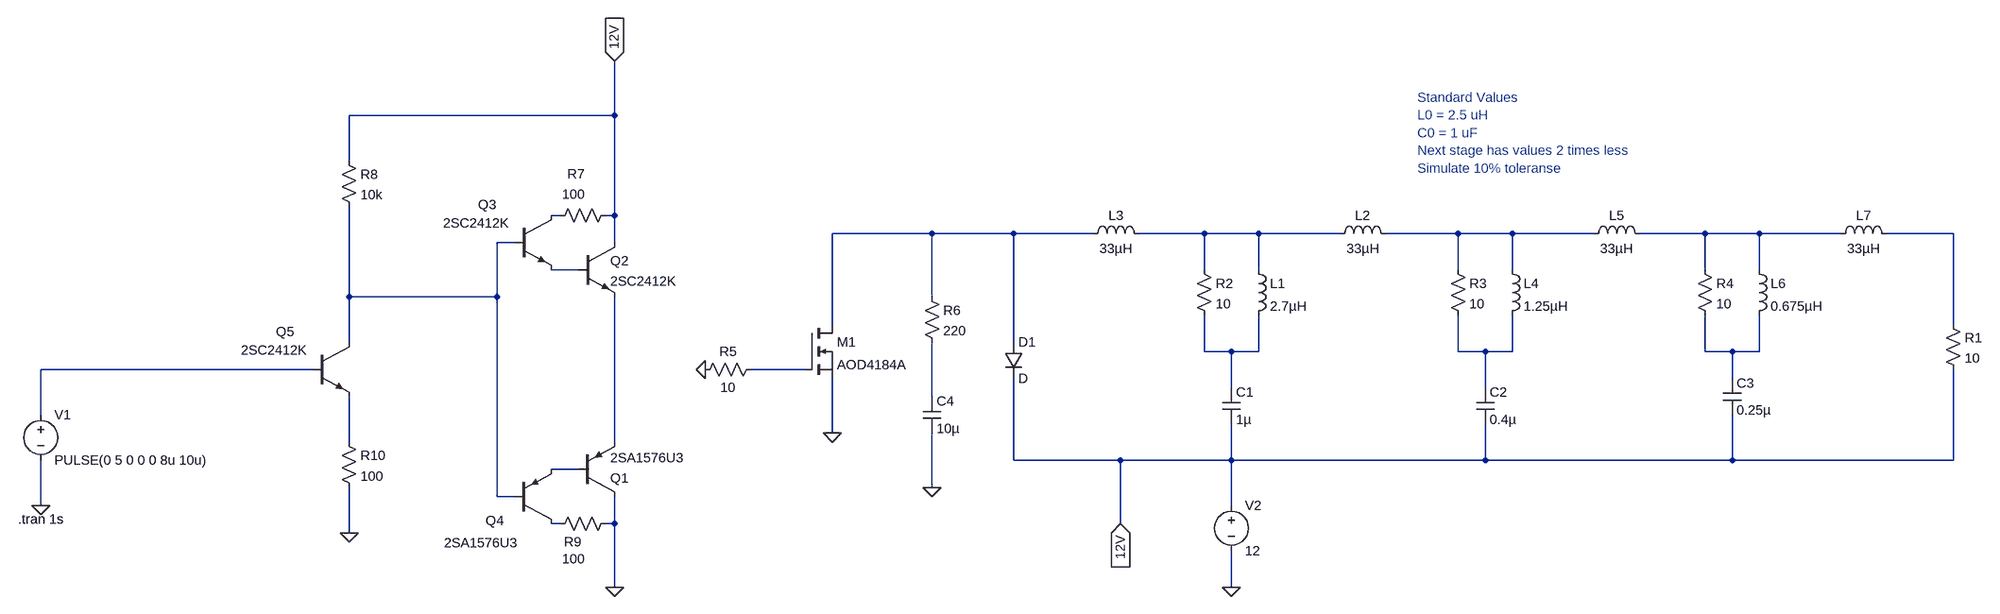
[diagram p0: schematic PWM_concept_05.asc]
PWM_concept_05.asc, the LTspice schematic file:
Version 4
SHEET 1 3368 680
WIRE -928 -176 -928 -272
WIRE -928 -176 -1520 -176
WIRE -1520 -96 -1520 -176
WIRE -1024 0 -1040 0
WIRE -928 0 -928 -176
WIRE -928 0 -944 0
WIRE -368 32 -544 32
WIRE -224 32 -368 32
WIRE -80 32 -224 32
WIRE 144 32 0 32
WIRE 240 32 144 32
WIRE 384 32 240 32
WIRE 592 32 464 32
WIRE 688 32 592 32
WIRE 832 32 688 32
WIRE 1056 32 912 32
WIRE 1152 32 1056 32
WIRE 1296 32 1152 32
WIRE 1504 32 1376 32
WIRE -1104 48 -1136 48
WIRE -928 48 -928 0
WIRE -992 96 -1040 96
WIRE 144 96 144 32
WIRE 240 96 240 32
WIRE 592 96 592 32
WIRE 688 96 688 32
WIRE 1056 96 1056 32
WIRE 1152 96 1152 32
WIRE -1520 144 -1520 -16
WIRE -1136 144 -1136 48
WIRE -1136 144 -1520 144
WIRE -368 144 -368 32
WIRE -544 192 -544 32
WIRE 1504 192 1504 32
WIRE -1520 224 -1520 144
WIRE -224 224 -224 32
WIRE 144 240 144 176
WIRE 192 240 144 240
WIRE 240 240 240 176
WIRE 240 240 192 240
WIRE 592 240 592 176
WIRE 640 240 592 240
WIRE 688 240 688 176
WIRE 688 240 640 240
WIRE 1056 240 1056 176
WIRE 1104 240 1056 240
WIRE 1152 240 1152 176
WIRE 1152 240 1104 240
WIRE -1584 272 -2064 272
WIRE -592 272 -688 272
WIRE 1104 288 1104 240
WIRE 192 304 192 240
WIRE 640 304 640 240
WIRE -368 320 -368 224
WIRE -2064 352 -2064 272
WIRE -544 384 -544 288
WIRE -1520 400 -1520 320
WIRE -928 400 -928 144
WIRE -224 432 -224 288
WIRE -32 432 -224 432
WIRE 192 432 192 368
WIRE 192 432 -32 432
WIRE 640 432 640 368
WIRE 640 432 192 432
WIRE 1104 432 1104 352
WIRE 1104 432 640 432
WIRE 1504 432 1504 272
WIRE 1504 432 1104 432
WIRE -992 448 -1040 448
WIRE -368 480 -368 384
WIRE -1136 496 -1136 144
WIRE -1104 496 -1136 496
WIRE -2064 512 -2064 432
WIRE 192 512 192 432
WIRE -1024 544 -1040 544
WIRE -928 544 -928 496
WIRE -928 544 -944 544
WIRE -32 544 -32 432
WIRE -1520 560 -1520 480
WIRE -928 656 -928 544
WIRE 192 656 192 592
FLAG -2064 512 0
FLAG -544 384 0
FLAG 192 656 0
FLAG -368 480 0
FLAG -928 656 0
FLAG -928 -272 12V
IOPIN -928 -272 In
FLAG -32 544 12V
IOPIN -32 544 In
FLAG -1520 560 0
FLAG -768 272 0
SYMBOL voltage -2064 336 R0
WINDOW 123 0 0 Left 0
WINDOW 39 0 0 Left 0
SYMATTR InstName V1
SYMATTR Value PULSE(0 5 0 0 0 8u 10u)
SYMBOL res 1488 176 R0
SYMATTR InstName R1
SYMATTR Value 10
SYMBOL cap 176 304 R0
SYMATTR InstName C1
SYMATTR Value 1µ
SYMBOL ind 224 80 R0
SYMATTR InstName L1
SYMATTR Value 2.7µH
SYMBOL ind 368 48 R270
WINDOW 0 32 56 VTop 2
WINDOW 3 5 56 VBottom 2
SYMATTR InstName L2
SYMATTR Value 33µH
SYMBOL ind -96 48 R270
WINDOW 0 32 56 VTop 2
WINDOW 3 5 56 VBottom 2
SYMATTR InstName L3
SYMATTR Value 33µH
SYMBOL cap 624 304 R0
SYMATTR InstName C2
SYMATTR Value 0.4µ
SYMBOL ind 672 80 R0
SYMATTR InstName L4
SYMATTR Value 1.25µH
SYMBOL ind 816 48 R270
WINDOW 0 32 56 VTop 2
WINDOW 3 5 56 VBottom 2
SYMATTR InstName L5
SYMATTR Value 33µH
SYMBOL cap 1088 288 R0
SYMATTR InstName C3
SYMATTR Value 0.25µ
SYMBOL ind 1136 80 R0
SYMATTR InstName L6
SYMATTR Value 0.675µH
SYMBOL ind 1280 48 R270
WINDOW 0 32 56 VTop 2
WINDOW 3 5 56 VBottom 2
SYMATTR InstName L7
SYMATTR Value 33µH
SYMBOL res 128 80 R0
SYMATTR InstName R2
SYMATTR Value 10
SYMBOL res 576 80 R0
SYMATTR InstName R3
SYMATTR Value 10
SYMBOL res 1040 80 R0
SYMATTR InstName R4
SYMATTR Value 10
SYMBOL res -672 256 R90
WINDOW 0 0 56 VBottom 2
WINDOW 3 32 56 VTop 2
SYMATTR InstName R5
SYMATTR Value 10
SYMBOL voltage 192 496 R0
WINDOW 123 0 0 Left 0
WINDOW 39 0 0 Left 0
SYMATTR InstName V2
SYMATTR Value 12
SYMBOL nmos -592 192 R0
SYMATTR InstName M1
SYMATTR Value AOD4184A
SYMBOL diode -240 224 R0
SYMATTR InstName D1
SYMBOL cap -384 320 R0
SYMATTR InstName C4
SYMATTR Value 10µ
SYMBOL res -384 128 R0
SYMATTR InstName R6
SYMATTR Value 220
SYMBOL pnp -992 496 M180
SYMATTR InstName Q1
SYMATTR Value 2SA1576U3
SYMBOL npn -992 48 R0
SYMATTR InstName Q2
SYMATTR Value 2SC2412K
SYMBOL npn -1104 0 R0
WINDOW 0 -65 -19 Left 2
WINDOW 3 -127 14 Left 2
SYMATTR InstName Q3
SYMATTR Value 2SC2412K
SYMBOL res -928 -16 R90
WINDOW 0 -41 68 VBottom 2
WINDOW 3 -37 72 VTop 2
SYMATTR InstName R7
SYMATTR Value 100
SYMBOL res -1536 -112 R0
SYMATTR InstName R8
SYMATTR Value 10k
SYMBOL pnp -1104 544 M180
WINDOW 0 -52 5 Left 2
WINDOW 3 -125 -34 Left 2
SYMATTR InstName Q4
SYMATTR Value 2SA1576U3
SYMBOL res -928 528 R90
WINDOW 0 64 74 VBottom 2
WINDOW 3 63 72 VTop 2
SYMATTR InstName R9
SYMATTR Value 100
SYMBOL npn -1584 224 R0
WINDOW 0 -65 -19 Left 2
WINDOW 3 -127 14 Left 2
SYMATTR InstName Q5
SYMATTR Value 2SC2412K
SYMBOL res -1536 384 R0
SYMATTR InstName R10
SYMATTR Value 100
TEXT -2104 536 Left 2 !.tran 1s
TEXT 520 -208 Left 2 ;Standard Values\nL0 = 2.5 uH\nC0 = 1 uF\nNext stage has values 2 times less\nSimulate 10% toleranse

The netlist it stands for:
* PWM_concept_05.asc
V1 N012 0 PULSE(0 5 0 0 0 8u 10u)
R1 N006 12V 10
C1 N009 12V 1µ
L1 N003 N009 2.7µH
L2 N003 N004 33µH
L3 N002 N003 33µH
C2 N010 12V 0.4µ
L4 N004 N010 1.25µH
L5 N004 N005 33µH
C3 N011 12V 0.25µ
L6 N005 N011 0.675µH
L7 N005 N006 33µH
R2 N003 N009 10
R3 N004 N010 10
R4 N005 N011 10
R5 N013 0 10
V2 12V 0 12
M1 N002 N013 0 0 AOD4184A
D1 N002 12V D
C4 N014 0 10µ
R6 N002 N014 220
Q1 0 N017 N016 0 2SA1576U3
Q2 12V N008 N016 0 2SC2412K
Q3 N001 N007 N008 0 2SC2412K
R7 12V N001 100
R8 12V N007 10k
Q4 N018 N007 N017 0 2SA1576U3
R9 0 N018 100
Q5 N007 N012 N015 0 2SC2412K
R10 N015 0 100
.model D D
.lib standard.dio
.model NPN NPN
.model PNP PNP
.lib standard.bjt
.model NMOS NMOS
.model PMOS PMOS
.lib standard.mos
.tran 1s
* Standard Values
* L0 = 2.5 uH
* C0 = 1 uF
* Next stage has values 2 times less
* Simulate 10% toleranse
.backanno
.end